# Altium schematic sheet PW.SchDoc
size A4; SheetNumber: 5; SheetTotal: 15
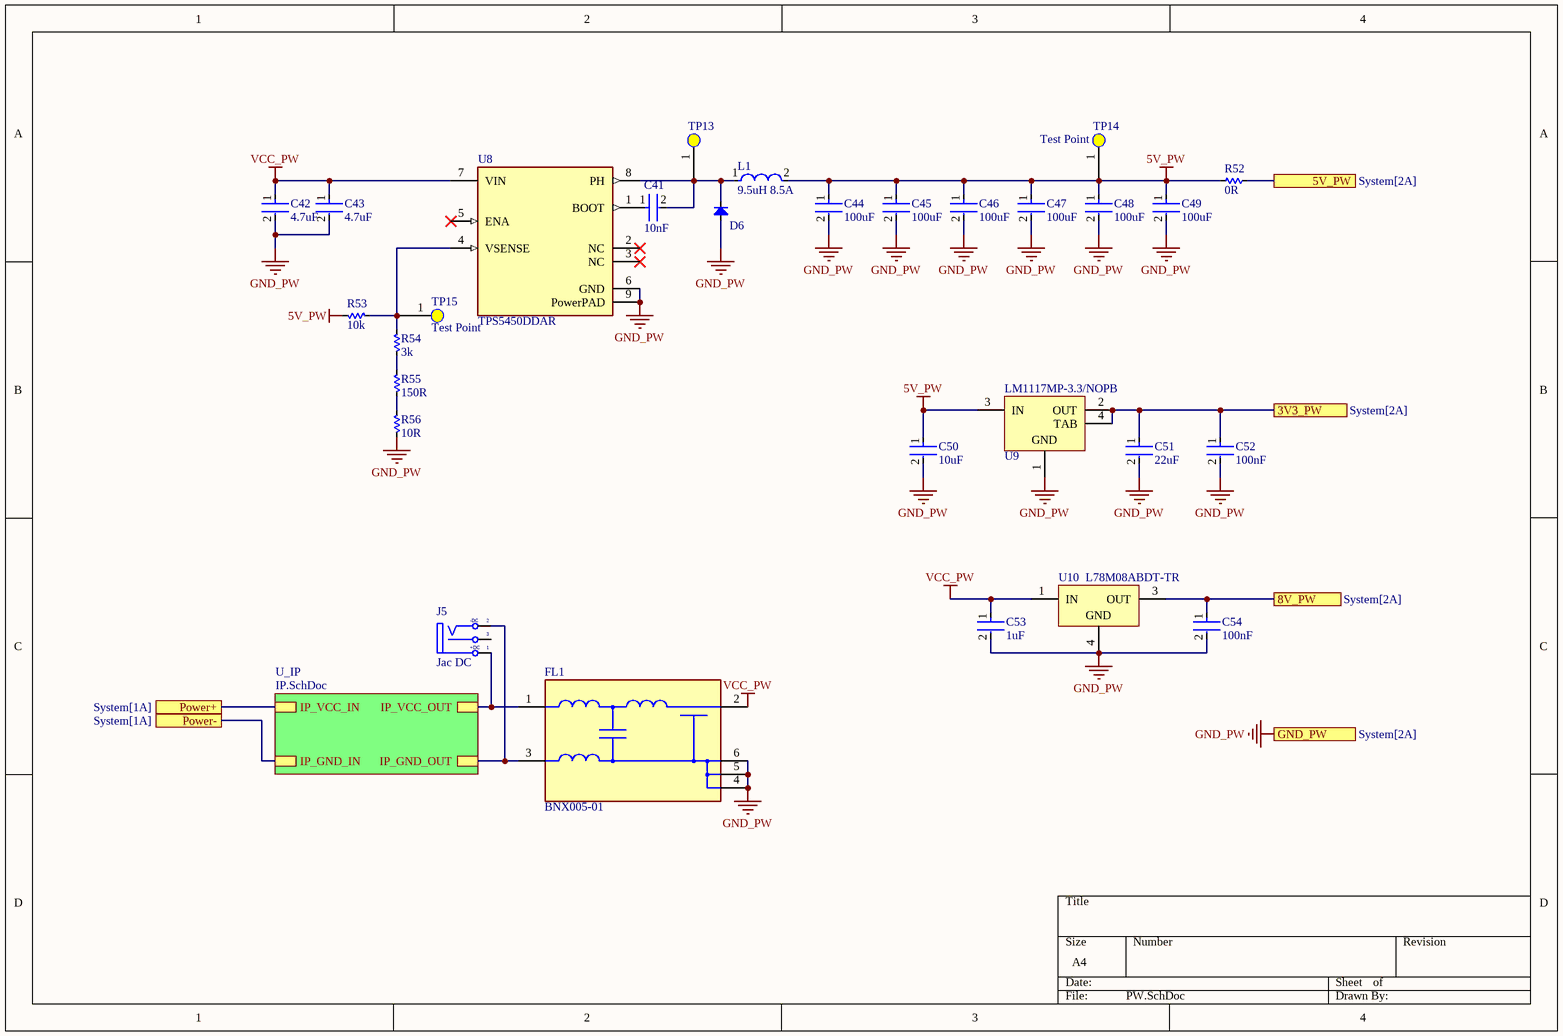
[diagram p0: PW.SchDoc]

## Parts
C41  10nF  [FP-GRM21B-0_1-IPC_A]
C42  4.7uF  [FP-C1210C107M9PACTU-IPC_A]
C43  4.7uF  [FP-C1210C107M9PACTU-IPC_A]
C44  100uF  [FP-C1210C107M9PACTU-IPC_A]
C45  100uF  [FP-C1210C107M9PACTU-IPC_A]
C46  100uF  [FP-C1210C107M9PACTU-IPC_A]
C47  100uF  [FP-C1210C107M9PACTU-IPC_A]
C48  100uF  [FP-C1210C107M9PACTU-IPC_A]
C49  100uF  [FP-C1210C107M9PACTU-IPC_A]
C50  10uF  [FP-GRM21B-0_15-MFG]
C51  22uF  [FP-GRM21B-0_15-MFG]
C52  100nF  [FP-GRM21B-0_15-MFG]
C53  1uF  [FP-C1206C-EB-MFG]
C54  100nF  [FP-C0603-CJ-MFG]
D6  SS54  [DIO-SMD-B]  (value not drawn)
FL1  BNX005-01  [FP-BNX_L12MM5_W11MM5_T13M-MFG]
J5  Jac DC  [DC0]
L1  9.5uH 8.5A  [CDEP147NP]
R52  0R  [RES-SMD-0805]
R53  10k  [RES-SMD-0603]
R54  3k  [RES-SMD-0603]
R55  150R  [RES-SMD-0603]
R56  10R  [RES-SMD-0603]
TP13  Test Point  [Test Point]  (value not drawn)
TP14  Test Point  [Test Point]
TP15  Test Point  [Test Point]
U8  TPS5450DDAR  [FP-DDA0008J-MFG]
U9  LM1117MP-3.3/NOPB  [DCY0004A_M]
U10  L78M08ABDT-TR  [TO-252_N]

## Sub-sheets
U_IP = IP.SchDoc: IP_VCC_OUT, IP_VCC_IN, IP_GND_IN, IP_GND_OUT

## Ports
3V3_PW (see System[2A]), 5V_PW (see System[2A]), 8V_PW (see System[2A]), GND_PW (see System[2A]), Power+ (see System[1A]), Power- (see System[1A])

## Nets
5V_PW: C44.1 C45.1 C46.1 C47.1 C48.1 C49.1 C50.1 L1.2 R52.2 R53.1 TP14.1(Test_Point) U9.3(IN)
GND_PW: C42.2 C43.2 C44.2 C45.2 C46.2 C47.2 C48.2 C49.2 C50.2 C51.2 C52.2 C53.2 C54.2 D6.1(A) FL1.4(CG) FL1.5(CG) FL1.6(CG) R56.2 U8.6(GND) U8.9(PowerPAD) U9.1(GND) U10.4(GND) ; port GND_PW
VCC_PW: C42.1 C43.1 C53.1 FL1.2(CB) U8.7(VIN) U10.1(IN)
3V3_PW: C51.1 C52.1 U9.2(OUT) U9.4(TAB) ; port 3V3_PW
5V_PW: R52.1 ; port 5V_PW  [a separate net that carries the same name]
8V_PW: C54.1 U10.3(OUT) ; port 8V_PW
Power+: port Power+, sheet U_IP/IP_VCC_IN
Power-: port Power-, sheet U_IP/IP_GND_IN
NetC41_1: C41.1 U8.1(BOOT)
NetC41_2: C41.2 D6.2(K) L1.1 TP13.1(Test_Point) U8.8(PH)
NetFL1_1: FL1.1(B) J5.1(T) ; sheet U_IP/IP_VCC_OUT
NetFL1_3: FL1.3(PSG) J5.2(TN) ; sheet U_IP/IP_GND_OUT
NetR53_2: R53.2 R54.1 TP15.1(Test_Point) U8.4(VSENSE)
NetR54_2: R54.2 R55.1
NetR55_2: R55.2 R56.1

Not connected (* = marked no-connect by the designer): J5 3(S); U8 2(NC)* 3(NC)* 5(ENA)*

## Notes on the sheet
- (in symbol DCIN) -DC; +DC

## Library data of the parts
C41 = CMP-2007-03453-2: 0805 10NF 50V; Voltage Rating (DC): 16V; Dielectric: X5R; Tolerance: 10%; Capacitance: 10uF; Material: Ceramic; Radiation Hardening: No; Thickness: 0.053inch; Lead Free: Lead Free; Package Quantity: 1; Width: 1.25mm; Case Code (Imperial): 0805; Depth: 1.25mm; Packaging: Tape and Reel; Max Operating Temperature: 85°C; Voltage Rating: 16V; Voltage: 16V; Height: 1.25mm; Case Code (Metric): 2012; Mount: Surface Mount; Case/Package: 0805; REACH SVHC: No SVHC; Length: 2mm; Min Operating Temperature: -55°C; Termination: SMD/SMT
C42 C43 = CMP-2000-06018-2: Tụ 4.7uF 1210 50V 10%; Voltage Rating (DC): 6.3V; Capacitance: 100uF; Dissipation Factor: 5%; Dielectric: X5R; Dielectric Material: Ceramic; Tolerance: 20%; Termination: SMD/SMT; REACH SVHC: No SVHC; Thickness: 0.11inch; Packaging: Tape and Reel; Series: C; Width: 2.5mm; Voltage: 6.3V; Contact Plating: Tin; Package Quantity: 1; Case/Package: 1210; Min Operating Temperature: -55°C; Height: 2.5mm; Radiation Hardening: No; Case Code (Metric): 3225; Depth: 2.5mm; Construction: Flat; Max Operating Temperature: 85°C; Number of Pins: 2; Mount: Surface Mount; Lead Free: Lead Free; RoHS Compliant: Yes; Voltage Rating: 6.3V; Length: 3.2mm; Case Code (Imperial): 1210
  C42: ComponentLink1Description: New link; ComponentLink1URL: https://linhkien.cxtvn.com/3437-tu-1210-khong-phan-cuc.html
C44-C49 = CMP-2000-06018-2: SMD 1210 100UF 107K 3225 25V 20% X5R; Voltage Rating (DC): 6.3V; Dissipation Factor: 5%; Dielectric Material: Ceramic; Termination: SMD/SMT; REACH SVHC: No SVHC; Thickness: 0.11inch; Packaging: Tape and Reel; Series: C; Width: 2.5mm; Voltage: 6.3V; Contact Plating: Tin; Package Quantity: 1; Case/Package: 1210; Min Operating Temperature: -55°C; Height: 2.5mm; Radiation Hardening: No; Capacitance: 100uF; Case Code (Metric): 3225; Depth: 2.5mm; Construction: Flat; Max Operating Temperature: 85°C; Number of Pins: 2; Mount: Surface Mount; Lead Free: Lead Free; RoHS Compliant: Yes; Voltage Rating: 6.3V; Dielectric: X5R; Length: 3.2mm; Case Code (Imperial): 1210; Tolerance: 20%
  C44: ComponentLink1Description: New link; ComponentLink1URL: https://cungcaplinhkien.vn/tu-gom-smd-1210-100uf-107k-3225-25v-20-x5r
C50 C52 = CMP-2007-03385-2: Cap 0805 10%; Material: Ceramic; Voltage: 6.3V; Dielectric: X5R; Tolerance: 20%; Capacitance: 22uF; Max Operating Temperature: 85°C; Min Operating Temperature: -55°C; Case/Package: 0805; Thickness: 0.053inch; Packaging: Tape and Reel; Depth: 1.25mm; Termination: SMD/SMT; Voltage Rating (DC): 6.3V; Radiation Hardening: No; Mount: Surface Mount; Lead Free: Lead Free; Package Quantity: 1; REACH SVHC: No SVHC; Voltage Rating: 6.3V; Length: 2mm; Case Code (Imperial): 0805; Case Code (Metric): 2012; Width: 0.049inch; Height: 1.25mm
C51 = CMP-2007-03385-2: Cap 0805 10%; Material: Ceramic; Voltage: 6.3V; Dielectric: X5R; Tolerance: 20%; Max Operating Temperature: 85°C; Min Operating Temperature: -55°C; Case/Package: 0805; Thickness: 0.053inch; Packaging: Tape and Reel; Depth: 1.25mm; Termination: SMD/SMT; Voltage Rating (DC): 6.3V; Radiation Hardening: No; Mount: Surface Mount; Lead Free: Lead Free; Package Quantity: 1; REACH SVHC: No SVHC; Voltage Rating: 6.3V; Capacitance: 22uF; Length: 2mm; Case Code (Imperial): 0805; Case Code (Metric): 2012; Width: 0.049inch; Height: 1.25mm
C53 = CMP-03020-000153-1: CAP CER 0.1UF 100V X7R 1206; Manufacturer: KEMET; Manufacturer Part Number: C1206C104K1RACTU; Value: 0.10 μF; Tolerance: 0.1; Material: Ceramic; Temperature Coefficient: 15%; Automotive Grade: Grade 0; Voltage Rating: 100 V; Automotive: Yes; Ipc Land Pattern Name: CAPC320160X78; Device Class L1: Passive Components; ComponentLink2Description: Datasheet; Temperature Range Low: -55°C; Category: Cap; Octopart: https://octopart.com/c1206c104k1ractu-kemet-89521; Height: 0.88mm; Lead Free: Yes; Digikey Description: CAP CER 0.1UF 100V X7R 1206; Mouser Description: CAP CER 0.1UF 100V X7R 1206; Device Class L3: Ceramic Capacitors; Device Class L2: Capacitors; ComponentLink2URL: https://content.kemet.com/datasheets/KEM_C1007_X8R_ULTRA_150C_SMD.pdf; Temperature Range High: +150°C; Temperature Characteristic: X7R; RoHS: TRUE; Capacitance: 0.10 μF; Package: C1206C-EB; Temperature: -55°C to +150°C
C54 = CMP-2006-03300-2: CAP CER 0.1UF 50V X7R 0603; Manufacturer Part Number: C0603X104K5RACTU; Manufacturer: Kemet; Material: Ceramic; Tolerance: 10%; Temperature Coefficient: 15%; Temperature Range High: +125°C; Temperature Range Low: -55°C; Voltage: 50V; ComponentLink2Description: Datasheet; RoHS: TRUE; ComponentLink2URL: https://content.kemet.com/datasheets/KEM_C1013_X7R_FT-CAP_SMD.pdf; Capacitance: 100nF; Device Class L3: Ceramic Capacitors; Device Class L2: Capacitors; Package: C0603-CJ; Height: 0.95mm; Device Class L1: Passive Components; Temperature Characteristic: X7R; Lead Free: Yes; Digikey Description: CAP CER 0.1UF 50V X7R 0603; Automotive: No; Value: 100nF; Mouser Description: Capacitor; Ceramic; Cap 0.1uF; Tol+10%; SMT; Flexible Termination; Vol-Rtg 50V; TR; Temperature: -55°C to +125°C; Octopart: https://octopart.com/c0603x104k5ractu-kemet-9145062; Category: Cap; Voltage Rating: 50V; Ipc Land Pattern Name: CAPC16080X80
D6 = Diode SMD: SMB; Code - JEDEC: DO-214-AB; Value: 1N5007; Published: 8-Jun-2000; Revision: July-2002: Re-released for DXP Platform.; Publisher: Altium Limited
FL1 = CMP-06051-000064-1: BNX005-01 FILTER LC TH 12x11mm; Max Current Rating: 15A; Voltage Rating: 50V; Number of Channels: 2; Attenuation Value: 40dB; Frequency: 1GHz; Impedance: 50R; Shielding: Unshielded; ESD Protection: No; Height: 13.5mm; Circuit Type: Filter; Package Quantity: 100; Radiation Hardening: No; Max Operating Temperature: 85°C; Packaging: Bulk; Current Rating: 15A; Width: 11mm; REACH SVHC: No SVHC; Mount: Through Hole; Depth: 11mm; Termination: PC Pins; Current: 15A; Contact Plating: Copper; Min Operating Temperature: -30°C; Max Voltage Rating (DC): 50V; Length: 12mm; Lead Free: Lead Free; ComponentLink1Description: New link; ComponentLink1URL: https://linhkien.cxtvn.com/10042-bnx005-01-filter-lc-th-12x11mm.html
J5 = DCIN: Jac DC input; Value: Jac DC
L1 = CDEP147NP: CEPD147NP-9R5MC Cuộn cảm 9.5uH 8.5A 14.5x14.5x8mm; ComponentLink1Description: New link; ComponentLink1URL: https://linhkien.cxtvn.com/10665-cepd147np-9r5mc-cuon-cam-95uh-85a-145x145x8mm.html
R52 = Res-SMD: Res 0805 1%; Manufacturer: Generic Components; Class: Passive; Published: 08/06/2000; Publisher: Altium Hobart Technology Centre
R53-R56 = Res-SMD: Res 0603 5%; Manufacturer: Generic Components; Class: Passive; Published: 08/06/2000; Publisher: Altium Hobart Technology Centre
U8 = CMP-04918-000100-1: TPS5450DDAR IC Reg Buck Adjustable 5A 8-PowerSOIC; Manufacturer: Texas Instruments; Output Type: AdjustableProgrammable; Output Voltage: 1.22-31V; Max Duty Cycle: 89%; Min Supply Voltage: 5.5V; Standoff Height: 0mm; Max Junction Temp: +125°C; Max Supply Voltage: 36V; Nominal Supply Current: 3mA; Number Of Outputs: 1; Switching Frequency: 500kHz; Device Class L3: Voltage Regulators - Switching; Octopart: https://octopart.com/tps5450ddar-texas+instruments-7105511; Temperature: -40°C to +125°C; Mouser Description: Conv DC-DC 5.5V to 36V Step Down Single-Out 1.22V to 31V 5A 8-Pin HSOP EP T/R; Device Class L1: Integrated Circuits (ICs); Automotive: No; Package: DDA0008J; Temperature Range Low: -40°C; RoHS: TRUE; Digikey Description: IC REG BUCK ADJUSTABLE 5A 8SOPWR; Lead Free: Yes; Manufacturer Part Number: TPS5450DDAR; Device Class L2: Power Management ICs; Temperature Range High: +125°C; Output Current: 5A; Height: 1.7mm; Ipc Land Pattern Name: SOIC127P600X170-8; Category: IC; Switching Topology: Buck; ComponentLink3Description: New link; ComponentLink3URL: https://linhkien.cxtvn.com/5009-tps5450ddar-ic-reg-buck-adjustable-5a-8-powersoic.html
U9 = CMP-0062-01638-4: 800mA Low-Dropout Linear Regulator, 4-pin SOT-223, Pb-Free; Manufacturer: Texas Instruments; CompType: LDO IC; PackageTopMarking: XYTT*N05A; High-Reliability: Y; PowerWise: N; ComponentLink1URL: http://www.ti.com/general/docs/lit/getliterature.tsp?genericPartNumber=LM1117-N&fileType=pdf; PinCount: 4; PackageDescription: Molded SOT-223, 6.50 x 3.56 x 1.6mm Body, 4 Lead, 2.3mm Pitch; Code_IPC: SOT223-4; PartNumber: LM1117MP-3.3/NOPB; Code_JEDEC: TO-261-AA; RoHS: Y; PackageReference: DCY0004A; ComponentLink1Description: Datasheet URL
U10 = CMP-0244-00195-1: Precision 500mA Regulator, 8V, 3-Pin DPAK, Tape and Reel; PackageVersion: 2011; ComponentLink1URL: http://www.st.com; ComponentLink1Description: Manufacturer URL; PackageDescription: 3-Pin Transistor Outline Package 2.28 mm Pitch, 9.7 mm Lead Span (DPAK); ComponentLink2URL: http://www.st.com/internet/com/TECHNICAL_RESOURCES/TECHNICAL_LITERATURE/DATASHEET/CD00000448.pdf; DatasheetVersion: 1/11/2010; PackageReference: TO-252; ComponentLink2Description: Datasheet